# EAGLE design xpark (EAGLE 6.4)
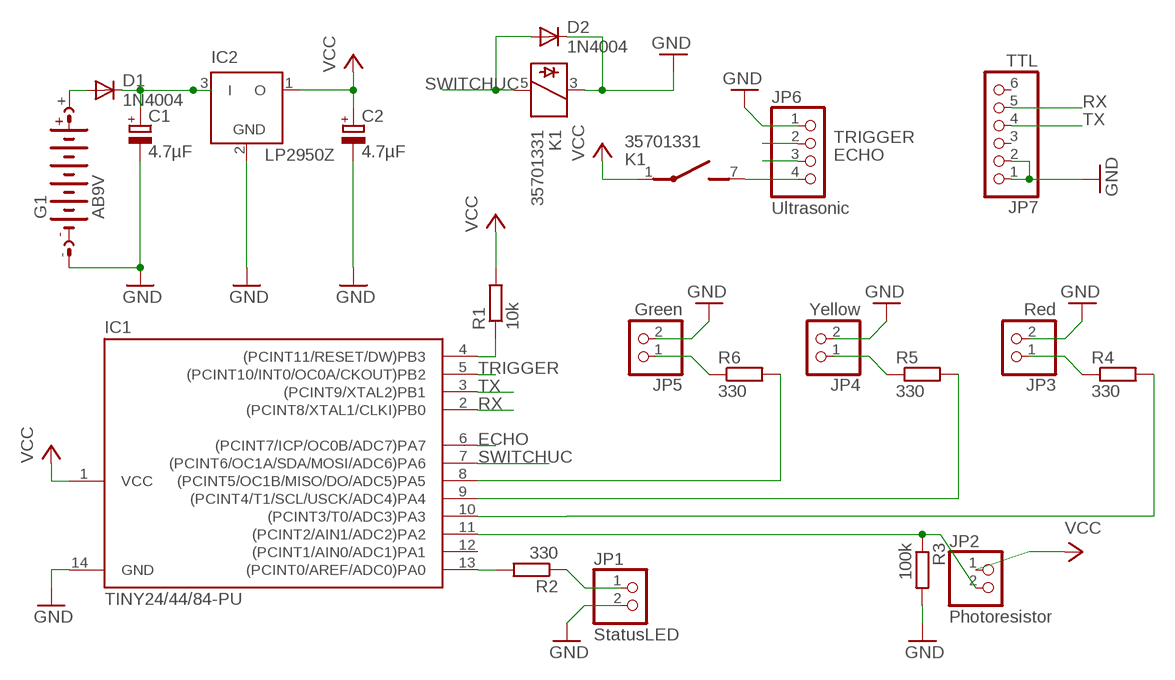
[diagram p0: schematic, sheet 1]

## Parts
C1  4.7µF  CPOL-EUE2.5-5  [E2,5-5]
C2  4.7µF  CPOL-EUE2.5-5  [E2,5-5]
D1  1N4004  [DO41-10]
D2  1N4004  [DO41-10]
G1  AB9V  [AB9V]
IC1  TINY24/44/84-PU  [DIL14]
IC2  LP2950Z  [TO92]
JP1  StatusLED  PINHD-1X2  [1X02]
JP2  Photoresistor  PINHD-1X2  [1X02]
JP3  Red  PINHD-1X2  [1X02]
JP4  Yellow  PINHD-1X2  [1X02]
JP5  Green  PINHD-1X2  [1X02]
JP6  Ultrasonic  PINHD-1X4  [1X04]
JP7  TTL  PINHD-1X6  [1X06]
K1  35701331  [REED]
R1  10k  R-EU_0204/7  [0204/7]
R2  330  R-EU_0204/7  [0204/7]
R3  100k  R-EU_0204/7  [0204/7]
R4  330  R-EU_0204/7  [0204/7]
R5  330  R-EU_0204/7  [0204/7]
R6  330  R-EU_0204/7  [0204/7]

## Nets
ECHO: IC1.6((PCINT7/ICP/OC0B/ADC7)PA7) JP6.3
GND: C1.- C2.- D2.C G1.- IC1.14(GND) IC2.2(GND) JP1.2 JP3.2 JP4.2 JP5.2 JP6.1 JP7.1 JP7.2 K1.3 R3.2
N$1: IC1.11((PCINT2/AIN1/ADC2)PA2) JP2.2 R3.1
N$2: IC1.4((PCINT11/RESET/DW)PB3) R1.1
N$3: JP6.4 K1.7(2:S)
N$4: IC1.8((PCINT5/OC1B/MISO/DO/ADC5)PA5) R6.2
N$5: D1.A G1.+
N$6: IC1.13((PCINT0/AREF/ADC0)PA0) R2.2
N$7: IC1.9((PCINT4/T1/SCL/USCK/ADC4)PA4) R5.2
N$8: IC1.10((PCINT3/T0/ADC3)PA3) R4.2
N$9: C1.+ D1.C IC2.3(I)
RX: IC1.2((PCINT8/XTAL1/CLKI)PB0) JP7.5
STATUSLED: JP1.1 R2.1
STATUSLED1: JP3.1 R4.1
STATUSLED2: JP4.1 R5.1
STATUSLED3: JP5.1 R6.1
SWITCHUC: D2.A IC1.7((PCINT6/OC1A/SDA/MOSI/ADC6)PA6) K1.5
TRIGGER: IC1.5((PCINT10/INT0/OC0A/CKOUT)PB2) JP6.2
TX: IC1.3((PCINT9/XTAL2)PB1) JP7.4
VCC: C2.+ IC1.1(VCC) IC2.1(O) JP2.1 K1.1(2:P) R1.2
Unconnected: IC1.12((PCINT1/AIN0/ADC1)PA1) JP7.3 JP7.6

## Library data of the parts
C1 C2 = rcl:CPOL-EU: POLARIZED CAPACITOR, European symbol
D1 D2 = diode:1N4004: DIODE general purpose rectifier, 1 A
G1 = battery:AB9V: 9-V BATTERY CLIP
IC1 = avr-7:TINY24/44/84
IC2 = linear:LP2950: 100 mA, Low Power Low Dropout Voltage Regulator Source: http://www.onsemi.com/pub/Collateral/LP2950-D.PDF
JP1-JP5 = pinhead:PINHD-1X2: PIN HEADER
JP6 = pinhead:PINHD-1X4: PIN HEADER
JP7 = pinhead:PINHD-1X6: PIN HEADER
K1 = relay:35701331: RELAY reed, 1 x norm. open with polarity; OC_FARNELL: unknown; OC_NEWARK: unknown
R1-R6 = rcl:R-EU_: RESISTOR, European symbol

## Net classes
0 default: width 0.406 mm, clearance 0.305 mm

## Board
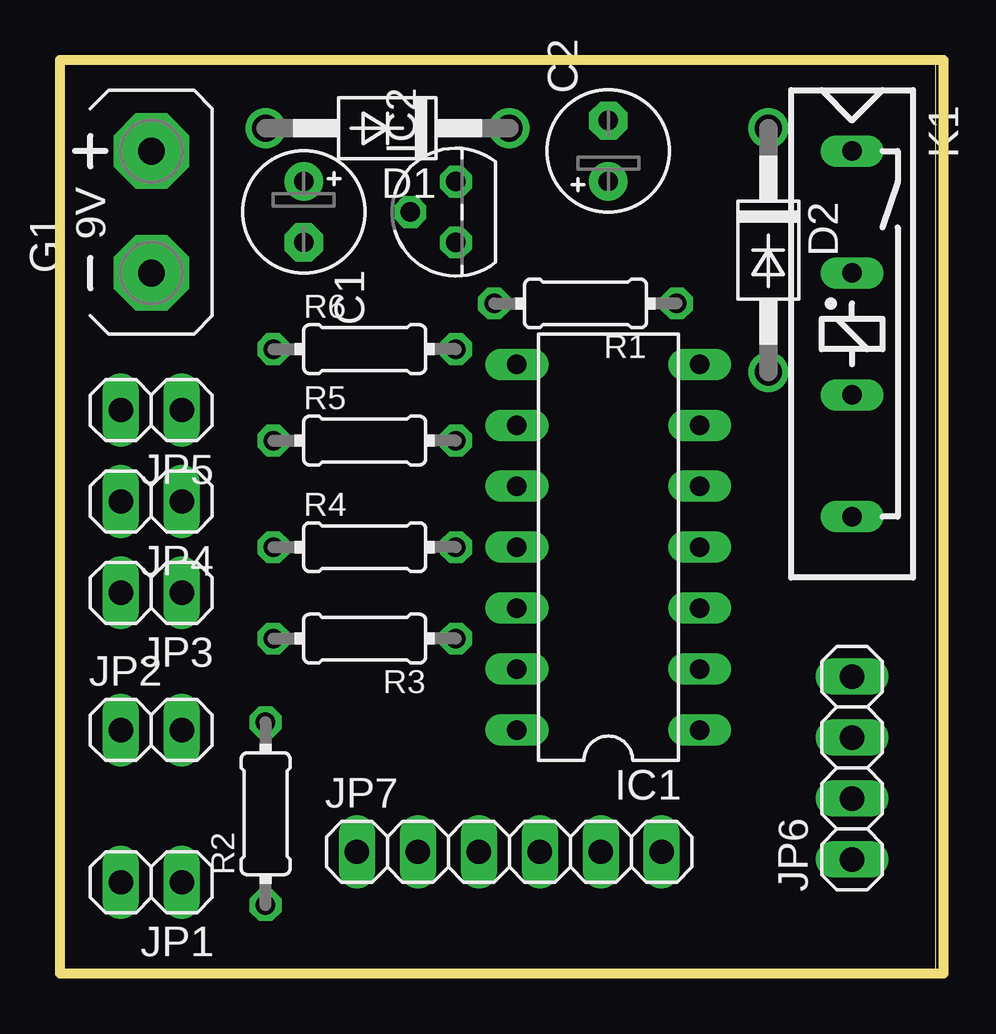
[diagram p1: board, top side]
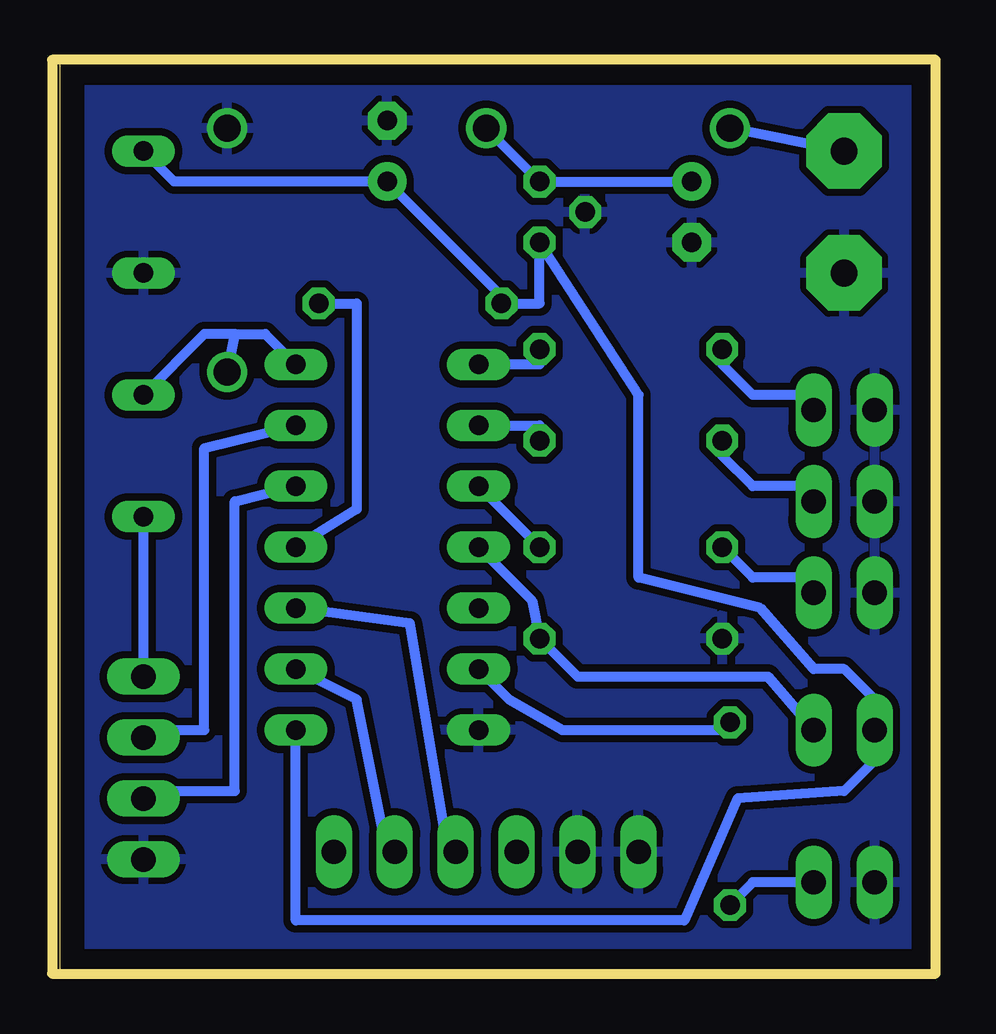
[diagram p2: board, bottom side, seen from below]

Size 36.5 x 38.09 mm. Coordinates in mm from the lower left corner, seen from the top.
Outline: 0,0 36.5,0 36.5,38.09 0,38.09 0,0
Copper layers (1*16): Top 0.035mm / dielectric 1.5mm / Bottom 0.035mm
Design rules "default": minimum track width 10mil, minimum drill 24mil, track to track 8mil, track to pad 8mil, pad to pad 8mil, via to via 8mil, smd to smd 8mil, copper to edge 40mil, drill to drill 8mil, minimum pad ring 10mil, minimum via ring 8mil, stop-mask expansion 4mil, vias tented up to drill 0mil, thermal gap 10mil
Milling: 4 lines

### Footprints (pad centres in the part's own frame; a part is rotated, then mirrored left to right if it is on the bottom)
E2,5-5 = drill 0.813 pad 1.6: + -1.27,0 | drill 0.813 pad 1.6 octagon: - 1.27,0
DO41-10 = drill 1.118: A 5.08,0; C -5.08,0
AB9V = drill 1.118 pad 3.15 octagon: + 0,2.54; - 0,-2.54
DIL14 = drill 0.813 long: 1 -7.62,-3.81; 2 -5.08,-3.81; 3 -2.54,-3.81; 4 0,-3.81; 5 2.54,-3.81; 6 5.08,-3.81; 7 7.62,-3.81; 8 7.62,3.81; 9 5.08,3.81; 10 2.54,3.81; 11 0,3.81; 12 -2.54,3.81; 13 -5.08,3.81; 14 -7.62,3.81
TO92 = drill 0.813 octagon: 1 -1.27,0; 2 0,1.905; 3 1.27,0
1X02 = drill 1.016 long: 1 -1.27,0; 2 1.27,0
1X04 = drill 1.016 long: 1 -3.81,0; 2 -1.27,0; 3 1.27,0; 4 3.81,0
1X06 = drill 1.016 long: 1 -6.35,0; 2 -3.81,0; 3 -1.27,0; 4 1.27,0; 5 3.81,0; 6 6.35,0
REED = drill 0.813 long: 1 -17.78,2.54; 3 -12.7,2.54; 5 -7.62,2.54; 7 -2.54,2.54
0204/7 = drill 0.813 octagon: 1 -3.81,0; 2 3.81,0

### Placement (x,y rotation side)
C1  10.16,31.75 270 top
C2  22.86,34.29 90 top
D1  13.65,35.24 180 top
D2  29.53,30.16 270 top
G1  3.81,31.75 0 top
IC1  22.86,17.78 90 top
IC2  16.51,31.75 90 top
JP1  3.81,3.81 180 top
JP2  3.81,10.16 0 top
JP3  3.81,15.88 180 top
JP4  3.81,19.68 180 top
JP5  3.81,23.5 180 top
JP6  33.02,8.57 90 top
JP7  18.73,5.08 0 top
K1  30.48,16.51 270 top
R1  21.91,27.94 180 top
R2  8.57,6.67 90 top
R3  12.7,13.97 180 top
R4  12.7,17.78 0 top
R5  12.7,22.23 0 top
R6  12.7,26.04 0 top

### Tracks (layer width: path | path; a pad name or v marks a point on that pad's centre or on a via)
ECHO
  Bottom 0.406: IC1.6 30.48,21.91 30.48,10.16 33.02,10.16 JP6.3
GND
  pour Bottom: 0,0 0,38.1 36.83,38.1 36.83,0
N$1
  Bottom 0.406: IC1.11 16.83,15.56 R3.1 14.92,12.38 6.99,12.38 JP2.2
N$2
  Bottom 0.406: IC1.4 24.13,19.37 24.13,27.94 R1.1
N$3
  Bottom 0.406: JP6.4 K1.7
N$4
  Bottom 0.406: IC1.8 16.51,25.4 R6.2
N$5
  Bottom 0.406: G1.+ D1.A
N$6
  Bottom 0.406: IC1.13 17.78,11.43 15.56,10.16 8.89,10.16 R2.2
N$7
  Bottom 0.406: IC1.9 16.51,22.86 R5.2
N$8
  Bottom 0.406: IC1.10 R4.2
N$9
  Bottom 0.406: C1.+ IC2.3 D1.C 19.05,35.56
RX
  Bottom 0.406: IC1.2 24.13,11.43 22.86,5.08 JP7.5
STATUSLED
  Bottom 0.406: JP1.1 7.62,3.81 R2.1 8.89,2.54
STATUSLED1
  Bottom 0.406: R4.1 7.62,16.51 5.08,16.51 JP3.1
STATUSLED2
  Bottom 0.406: R5.1 8.89,21.59 7.62,20.32 5.08,20.32 JP4.1
STATUSLED3
  Bottom 0.406: R6.1 8.89,25.4 7.62,24.13 5.08,24.13 JP5.1
SWITCHUC
  Bottom 0.406: K1.5 30.48,26.67 29.21,26.67 | IC1.7 27.94,26.67 29.21,26.67 | 29.21,26.67 D2.A
TRIGGER
  Bottom 0.406: IC1.5 29.21,19.68 29.21,7.62 33.02,7.62 JP6.2
TX
  Bottom 0.406: IC1.3 21.91,14.61 20.32,5.08 JP7.4
VCC
  Bottom 0.406: 17.78,27.94 16.51,27.94 IC2.1 12.38,24.13 12.38,16.51 7.3,15.24 5.08,12.7 3.81,12.7 2.54,11.43 JP2.1 2.54,8.89 3.81,7.62 8.26,7.3 10.48,2.22 26.67,2.22 IC1.1 | K1.1 31.75,33.02 C2.+ 17.78,27.94 | 17.78,27.94 R1.2